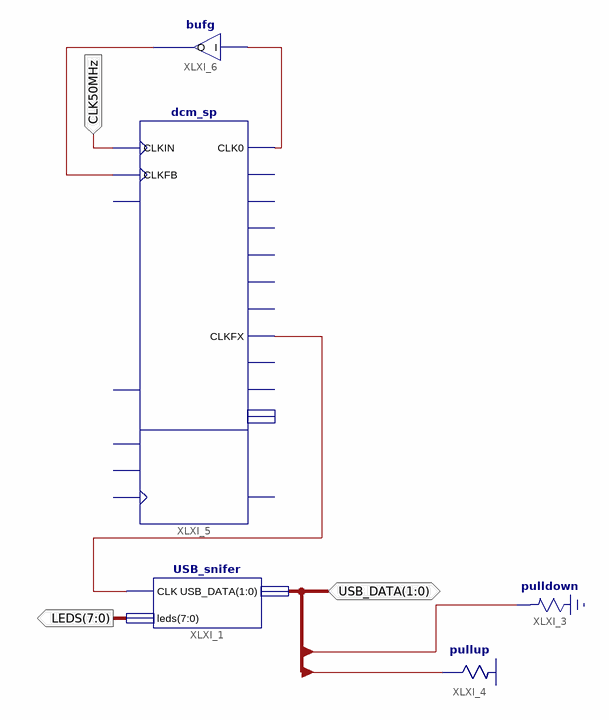
[diagram p0: schematic sheet 1]
// Xilinx ISE schematic USB_snifer_schema.sch (spartan3e) as structural Verilog: 5 symbols, 3 ports
module USB_snifer_schema (
  input  CLK50MHz,
  inout  [1:0] USB_DATA,
  output [7:0] LEDS
);

  wire XLXN_1, XLXN_2, XLXN_7;

  dcm_sp #(.CLKFX_MULTIPLY(2)) XLXI_5 (
    .CLKFB(XLXN_2), .CLKIN(CLK50MHz), .CLK0(XLXN_1), .CLKFX(XLXN_7));  // open: DSSEN, PSCLK, PSEN, PSINCDEC, RST, CLK180, CLK270, CLK2X, CLK2X180, CLK90, CLKDV, CLKFX180, LOCKED, PSDONE, STATUS
  bufg XLXI_6 (.I(XLXN_1), .O(XLXN_2));
  USB_snifer XLXI_1 (.USB_DATA(USB_DATA), .CLK(XLXN_7), .leds(LEDS));
  \pullup  XLXI_4 (.O(USB_DATA[1]));
  \pulldown  XLXI_3 (.O(USB_DATA[0]));
endmodule
